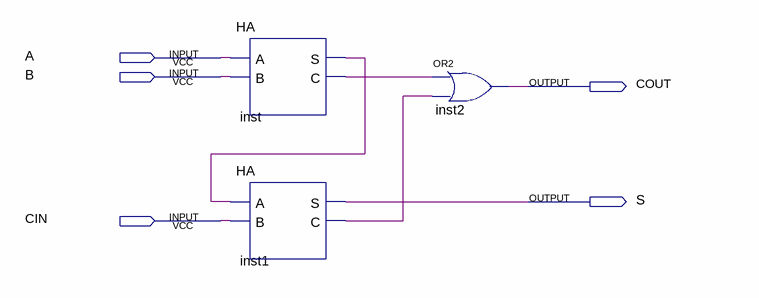
[diagram p0: schematic sheet]
// Quartus schematic HAFA.bdf as structural Verilog: 3 symbols, 5 pins
module HAFA (
  input  A,
  input  B,
  input  CIN,
  output COUT,
  output S
);

  wire inst1_c, inst_c, inst_s;

  HA inst (.A(A), .B(B), .S(inst_s), .C(inst_c));
  HA inst1 (.A(inst_s), .B(CIN), .S(S), .C(inst1_c));
  or inst2 (COUT, inst_c, inst1_c);
endmodule
